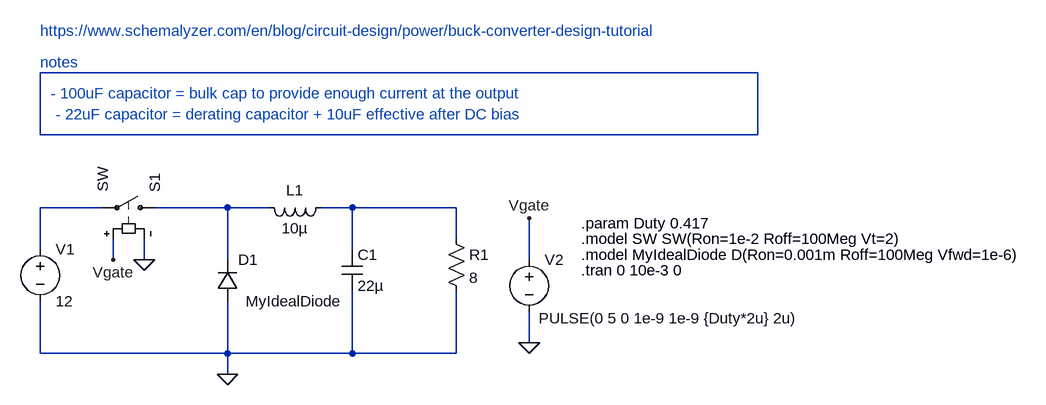
[diagram p0: schematic buck_converter_project.asc]
buck_converter_project.asc, the LTspice schematic file:
Version 4.1
SHEET 1 1868 728
WIRE -3904 -160 -5008 -160
WIRE -5008 -64 -5008 -160
WIRE -3904 -64 -3904 -160
WIRE -3904 -64 -5008 -64
WIRE -4912 48 -5008 48
WIRE -4720 48 -4832 48
WIRE -4656 48 -4720 48
WIRE -4528 48 -4576 48
WIRE -4368 48 -4528 48
WIRE -4368 96 -4368 48
WIRE -5008 112 -5008 48
WIRE -4528 112 -4528 48
WIRE -4896 128 -4896 96
WIRE -4848 128 -4848 96
WIRE -4720 128 -4720 48
WIRE -4256 128 -4256 64
WIRE -4256 256 -4256 208
WIRE -5008 272 -5008 192
WIRE -4720 272 -4720 192
WIRE -4720 272 -5008 272
WIRE -4528 272 -4528 176
WIRE -4528 272 -4720 272
WIRE -4368 272 -4368 176
WIRE -4368 272 -4528 272
WIRE -4720 304 -4720 272
FLAG -4720 304 0
FLAG -4256 256 0
FLAG -4256 64 Vgate
FLAG -4896 128 Vgate
FLAG -4848 128 0
SYMBOL voltage -5008 96 R0
SYMATTR InstName V1
SYMATTR Value 12
SYMBOL voltage -4256 112 R0
WINDOW 123 0 0 Left 0
WINDOW 39 0 0 Left 0
WINDOW 3 15 106 Left 2
SYMATTR Value PULSE(0 5 0 1e-9 1e-9 {Duty*2u} 2u)
SYMATTR InstName V2
SYMBOL sw -4816 48 M270
SYMATTR InstName S1
SYMBOL ind -4560 32 R90
WINDOW 0 5 56 VBottom 2
WINDOW 3 32 56 VTop 2
SYMATTR InstName L1
SYMATTR Value 10µ
SYMBOL cap -4544 112 R0
SYMATTR InstName C1
SYMATTR Value 22µ
SYMBOL res -4384 80 R0
SYMATTR InstName R1
SYMATTR Value 8
SYMBOL diode -4704 192 R180
WINDOW 0 -31 64 Left 2
WINDOW 3 -160 0 Left 2
SYMATTR InstName D1
SYMATTR Value MyIdealDiode
TEXT -5008 -224 Left 2 ;https://www.schemalyzer.com/en/blog/circuit-design/power/buck-converter-design-tutorial
TEXT -4992 -128 Left 2 ;- 100uF capacitor = bulk cap to provide enough current at the output
TEXT -4984 -96 Left 2 ;- 22uF capacitor = derating capacitor + 10uF effective after DC bias
TEXT -5008 -176 Left 2 ;notes
TEXT -4176 72 Left 2 !.param Duty 0.417
TEXT -4176 96 Left 2 !.model SW SW(Ron=1e-2 Roff=100Meg Vt=2)
TEXT -4176 120 Left 2 !.model MyIdealDiode D(Ron=0.001m Roff=100Meg Vfwd=1e-6)
TEXT -4176 144 Left 2 !.tran 0 10e-3 0

The netlist it stands for:
* buck_converter_project.asc
V1 N002 0 12
V2 Vgate 0 PULSE(0 5 0 1e-9 1e-9 {Duty*2u} 2u)
S1 N003 N002 Vgate 0 SW
L1 N004 N003 10µ
C1 N004 0 22µ
R1 N004 0 8
D1 0 N003 MyIdealDiode
.model D D
.lib standard.dio
* https://www.schemalyzer.com/en/blog/circuit-design/power/buck-converter-design-tutorial
* - 100uF capacitor = bulk cap to provide enough current at the output
* - 22uF capacitor = derating capacitor + 10uF effective after DC bias
* notes
.param Duty 0.417
.model SW SW(Ron=1e-2 Roff=100Meg Vt=2)
.model MyIdealDiode D(Ron=0.001m Roff=100Meg Vfwd=1e-6)
.tran 0 10e-3 0
.backanno
.end